# EAGLE design PIO-Breakout (EAGLE 9.6.2)
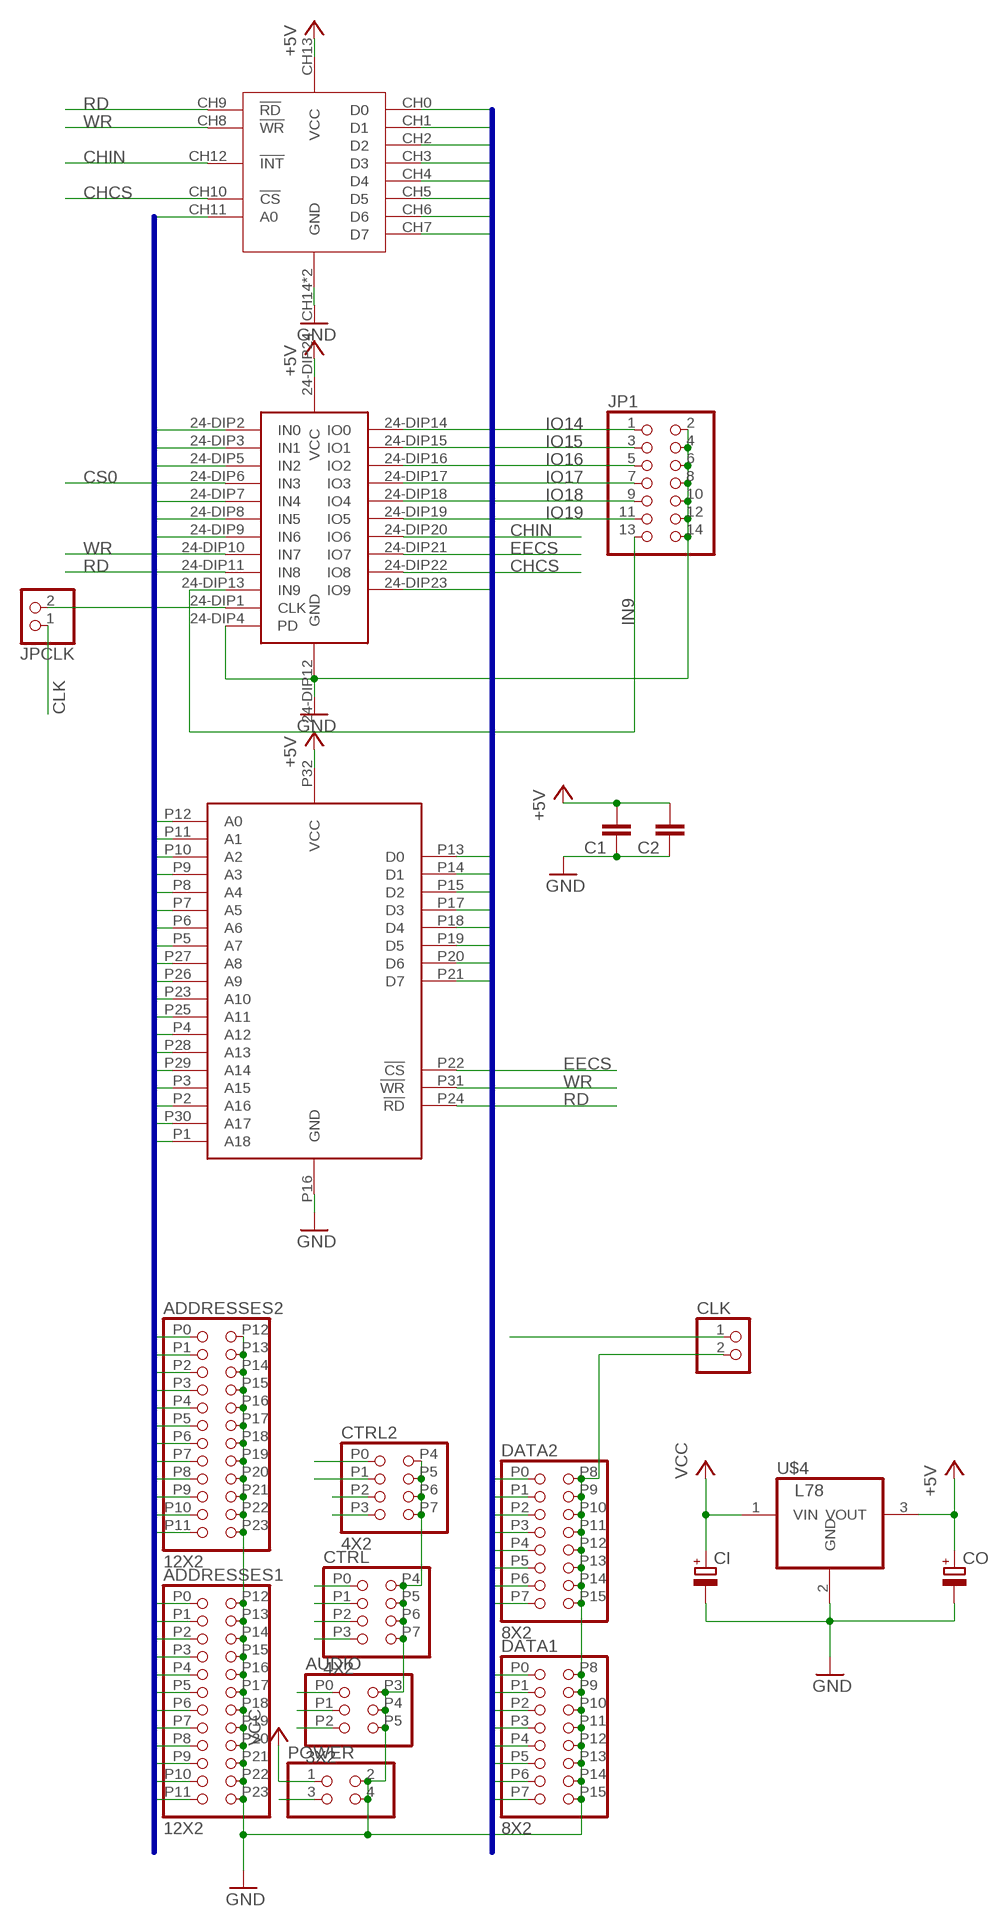
[diagram p0: schematic, sheet 1]

## Parts
ADDRESSES1  12X2  [12X2]
ADDRESSES2  12X2  [12X2]
AUDIO  3X2  [3X2]
C1  C-EU025-024X044  [C025-024X044]
C2  C-EU025-024X044  [C025-024X044]
CI  CPOL-EUE2,5-6E  [E2,5-6E]
CLK  PINHD-1X2  [1X02]
CO  CPOL-EUE2,5-6E  [E2,5-6E]
CTRL  4X2  [4X2]
CTRL2  4X2  [4X2]
DATA1  8X2  [8X2]
DATA2  8X2  [8X2]
JP1  PINHD-2X7  [2X07]
JPCLK  PINHD-1X2  [1X02]
POWER  PINHD-2X2  [2X02]
U$1  AT29C040A  [DIP-32]
U$2  ATF22V10C-10PU  [24-DIP]
U$3  CH375B-BOARD  [CH375B-BOARD]
U$4  L78  [TO-220-HEATSINK]

## Nets
+3V3: POWER.3
+5V: C1.2 C2.2 CO.+ U$1.P32(VCC) U$2.24-DIP24(VCC) U$3.CH13(VCC) U$4.3(VOUT)
A0: ADDRESSES1.P11 U$1.P12(A0) U$2.24-DIP2(IN0) U$3.CH11(A0)
A1: ADDRESSES2.P11 U$1.P11(A1) U$2.24-DIP3(IN1)
A2: ADDRESSES1.P10 U$1.P10(A2) U$2.24-DIP5(IN2)
A3: ADDRESSES2.P10 U$1.P9(A3)
A4: ADDRESSES1.P9 U$1.P8(A4)
A5: ADDRESSES2.P9 U$1.P7(A5)
A6: ADDRESSES1.P8 U$1.P6(A6)
A7: ADDRESSES2.P8 U$1.P5(A7)
A8: ADDRESSES1.P7 U$1.P27(A8)
A9: ADDRESSES2.P7 U$1.P26(A9)
A10: ADDRESSES1.P6 U$1.P23(A10)
A11: ADDRESSES2.P6 U$1.P25(A11)
A12: ADDRESSES1.P5 U$1.P4(A12)
A13: ADDRESSES2.P5 U$1.P28(A13)
A14: ADDRESSES1.P4 U$1.P29(A14)
A15: ADDRESSES2.P4 U$1.P3(A15)
A16: ADDRESSES1.P3 U$1.P2(A16) U$2.24-DIP7(IN4)
A17: ADDRESSES2.P3 U$1.P30(A17) U$2.24-DIP8(IN5)
A18: ADDRESSES1.P2 U$1.P1(A18) U$2.24-DIP9(IN6)
A19: ADDRESSES2.P2
A20: ADDRESSES1.P1
A21: ADDRESSES2.P1
A22: ADDRESSES1.P0
A23: ADDRESSES2.P0
BCLK: AUDIO.P2
CHCS: U$2.24-DIP22(IO8) U$3.CH10(!CS)
CHIN: U$2.24-DIP20(IO6) U$3.CH12(!INT)
CLK: CLK.1 JPCLK.1
CS0: CTRL.P0 U$2.24-DIP6(IN3)
CS2: CTRL.P1
CS5: CTRL2.P0
D0: DATA1.P7 U$1.P13(D0) U$2.24-DIP23(IO9) U$3.CH0(D0)
D1: DATA2.P7 U$1.P14(D1) U$3.CH1(D1)
D2: DATA1.P6 U$1.P15(D2) U$3.CH2(D2)
D3: DATA2.P6 U$1.P17(D3) U$3.CH3(D3)
D4: DATA1.P5 U$1.P18(D4) U$3.CH4(D4)
D5: DATA2.P5 U$1.P19(D5) U$3.CH5(D5)
D6: DATA1.P4 U$1.P20(D6) U$3.CH6(D6)
D7: DATA2.P4 U$1.P21(D7) U$3.CH7(D7)
D8: DATA1.P3
D9: DATA2.P3
D10: DATA1.P2
D11: DATA2.P2
D12: DATA1.P1
D13: DATA2.P1
D14: DATA1.P0
D15: DATA2.P0
EECS: U$1.P22(!CS) U$2.24-DIP21(IO7)
GND: ADDRESSES1.P12 ADDRESSES1.P13 ADDRESSES1.P14 ADDRESSES1.P15 ADDRESSES1.P16 ADDRESSES1.P17 ADDRESSES1.P18 ADDRESSES1.P19 ADDRESSES1.P20 ADDRESSES1.P21 ADDRESSES1.P22 ADDRESSES1.P23 ADDRESSES2.P12 ADDRESSES2.P13 ADDRESSES2.P14 ADDRESSES2.P15 ADDRESSES2.P16 ADDRESSES2.P17 ADDRESSES2.P18 ADDRESSES2.P19 ADDRESSES2.P20 ADDRESSES2.P21 ADDRESSES2.P22 ADDRESSES2.P23 AUDIO.P3 AUDIO.P4 AUDIO.P5 C1.1 C2.1 CI.- CLK.2 CO.- CTRL2.P4 CTRL2.P5 CTRL2.P6 CTRL2.P7 CTRL.P4 CTRL.P5 CTRL.P6 CTRL.P7 DATA1.P8 DATA1.P9 DATA1.P10 DATA1.P11 DATA1.P12 DATA1.P13 DATA1.P14 DATA1.P15 DATA2.P8 DATA2.P9 DATA2.P10 DATA2.P11 DATA2.P12 DATA2.P13 DATA2.P14 DATA2.P15 JP1.2 JP1.4 JP1.6 JP1.8 JP1.10 JP1.12 JP1.14 POWER.2 POWER.4 U$1.P16(GND) U$2.24-DIP4(PD) U$2.24-DIP12(GND) U$3.CH14(GND) U$3.CH15(GND) U$4.2(GND)
IN2: CTRL2.P1
IN9: JP1.13 U$2.24-DIP13(IN9)
IN10: CTRL.P2
IO14: JP1.1 U$2.24-DIP14(IO0)
IO15: JP1.3 U$2.24-DIP15(IO1)
IO16: JP1.5 U$2.24-DIP16(IO2)
IO17: JP1.7 U$2.24-DIP17(IO3)
IO18: JP1.9 U$2.24-DIP18(IO4)
IO19: JP1.11 U$2.24-DIP19(IO5)
LRCLK: AUDIO.P1
MCLK: JPCLK.2 U$2.24-DIP1(CLK)
RD: CTRL2.P2 U$1.P24(!RD) U$2.24-DIP11(IN8) U$3.CH9(!RD)
RESET: CTRL.P3
SDIN: AUDIO.P0
VCC: CI.+ POWER.1 U$4.1(VIN)
WR: CTRL2.P3 U$1.P31(!WR) U$2.24-DIP10(IN7) U$3.CH8(!WR)

## Buses
A0,A1,A2,A3,A4,A5,A6,A7,A8,A9,A10,A11,A12,A13,A14,A15,A16,A17,A18,A19,A20,A21,A22,A23
D0,D1,D2,D3,D4,D5,D6,D7,D8,D9,D10,D11,D12,D13,D14,D15

## Library data of the parts
ADDRESSES1 ADDRESSES2 = pixel:12X2
AUDIO = pixel:3X2
C1 C2 = rcl:C-EU: CAPACITOR, European symbol; SPICEPREFIX: C
CI CO = rcl:CPOL-EU: POLARIZED CAPACITOR, European symbol; SPICEPREFIX: C
CLK JPCLK = pinhead:PINHD-1X2: PIN HEADER
CTRL CTRL2 = pixel:4X2
DATA1 DATA2 = pixel:8X2
JP1 = pinhead:PINHD-2X7: PIN HEADER
POWER = pinhead:PINHD-2X2: PIN HEADER
U$1 = pixel:AT29C040A
U$2 = pixel:ATF22V10C-10PU
U$3 = pixel:CH375B-BOARD
U$4 = pixel:L78

## Board
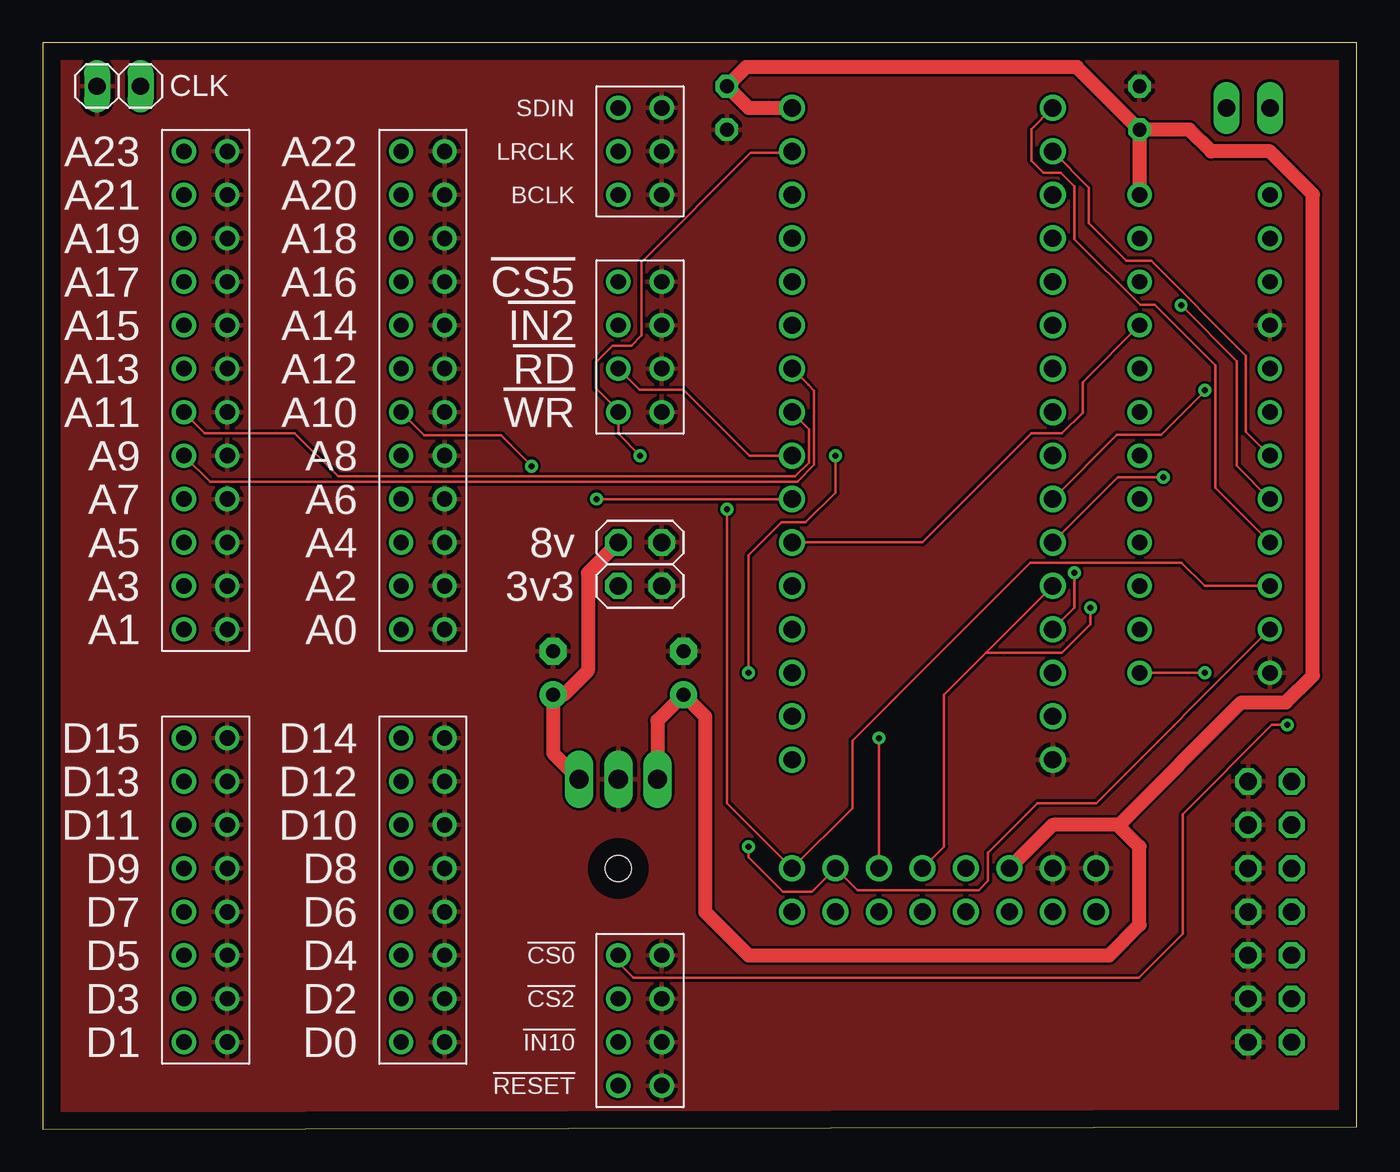
[diagram p1: board, top side]
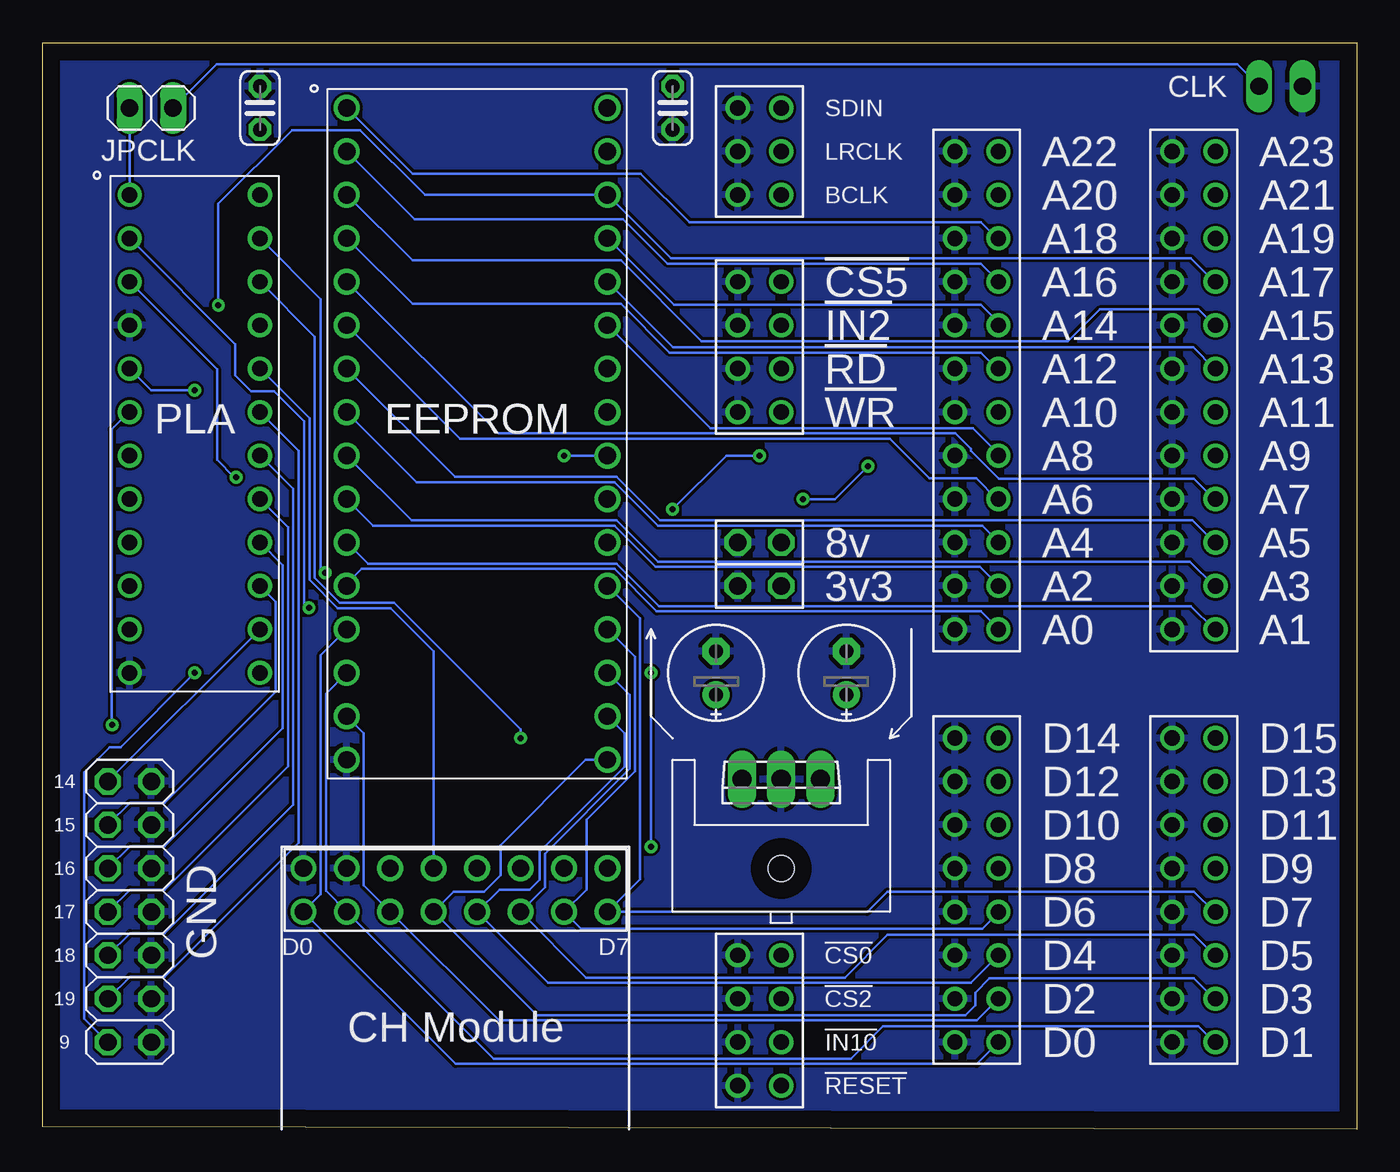
[diagram p2: board, bottom side, seen from below]

Size 76.83 x 63.5 mm. Coordinates in mm from the lower left corner, seen from the top.
Outline: 0,0 76.83,0.13 76.83,63.5 0,63.5 0,0
Copper layers (1*16): Top 0.035mm / dielectric 1.5mm / Bottom 0.035mm
Design rules "default *": minimum track width 6mil, minimum drill 10mil, track to track 6mil, track to pad 6mil, pad to pad 6mil, via to via 6mil, smd to smd 6mil, copper to edge 40mil, drill to drill 6mil, minimum pad ring 10mil, minimum via ring 8mil, stop-mask expansion 4mil, vias tented up to drill 500mil, thermal gap 10mil

### Footprints (pad centres in the part's own frame; a part is rotated, then mirrored left to right if it is on the bottom)
12X2 = drill 0.9 pad 1.27: P0 -1.27,13.97; P1 -1.27,11.43; P2 -1.27,8.89; P3 -1.27,6.35; P4 -1.27,3.81; P5 -1.27,1.27; P6 -1.27,-1.27; P7 -1.27,-3.81; P8 -1.27,-6.35; P9 -1.27,-8.89; P10 -1.27,-11.43; P11 -1.27,-13.97; P12 1.27,-13.97; P13 1.27,-11.43; P14 1.27,-8.89; P15 1.27,-6.35; P16 1.27,-3.81; P17 1.27,-1.27; P18 1.27,1.27; P19 1.27,3.81; P20 1.27,6.35; P21 1.27,8.89; P22 1.27,11.43; P23 1.27,13.97
3X2 = drill 0.9 pad 1.27: P0 -1.27,2.54; P1 -1.27,0; P2 -1.27,-2.54; P3 1.27,-2.54; P4 1.27,0; P5 1.27,2.54
C025-024X044 = drill 0.813 octagon: 1 -1.27,0; 2 1.27,0
E2,5-6E = drill 0.813 pad 1.575: + -1.27,0 | drill 0.813 pad 1.575 octagon: - 1.27,0
1X02 = drill 1.016 long: 1 -1.27,0; 2 1.27,0
4X2 = drill 0.9 pad 1.27: P0 -1.27,3.81; P1 -1.27,1.27; P2 -1.27,-1.27; P3 -1.27,-3.81; P4 1.27,-3.81; P5 1.27,-1.27; P6 1.27,1.27; P7 1.27,3.81
8X2 = drill 0.9 pad 1.27: P0 -1.27,8.89; P1 -1.27,6.35; P2 -1.27,3.81; P3 -1.27,1.27; P4 -1.27,-1.27; P5 -1.27,-3.81; P6 -1.27,-6.35; P7 -1.27,-8.89; P8 1.27,-8.89; P9 1.27,-6.35; P10 1.27,-3.81; P11 1.27,-1.27; P12 1.27,1.27; P13 1.27,3.81; P14 1.27,6.35; P15 1.27,8.89
2X07 = drill 1.016 octagon: 1 -7.62,-1.27; 2 -7.62,1.27; 3 -5.08,-1.27; 4 -5.08,1.27; 5 -2.54,-1.27; 6 -2.54,1.27; 7 0,-1.27; 8 0,1.27; 9 2.54,-1.27; 10 2.54,1.27; 11 5.08,-1.27; 12 5.08,1.27; 13 7.62,-1.27; 14 7.62,1.27
2X02 = drill 1.016 octagon: 1 -1.27,-1.27; 2 -1.27,1.27; 3 1.27,-1.27; 4 1.27,1.27
DIP-32 = drill 1.016: P1 -7.62,19.05; P2 -7.62,16.51; P3 -7.62,13.97; P4 -7.62,11.43; P5 -7.62,8.89; P6 -7.62,6.35; P7 -7.62,3.81; P8 -7.62,1.27; P9 -7.62,-1.27; P10 -7.62,-3.81; P11 -7.62,-6.35; P12 -7.62,-8.89; P13 -7.62,-11.43; P14 -7.62,-13.97; P15 -7.62,-16.51; P16 -7.62,-19.05; P17 7.62,-19.05; P18 7.62,-16.51; P19 7.62,-13.97; P20 7.62,-11.43; P21 7.62,-8.89; P22 7.62,-6.35; P23 7.62,-3.81; P24 7.62,-1.27; P25 7.62,1.27; P26 7.62,3.81; P27 7.62,6.35; P28 7.62,8.89; P29 7.62,11.43; P30 7.62,13.97; P31 7.62,16.51; P32 7.62,19.05
24-DIP = drill 0.9: 24-DIP1 -3.81,13.97; 24-DIP2 -3.81,11.43; 24-DIP3 -3.81,8.89; 24-DIP4 -3.81,6.35; 24-DIP5 -3.81,3.81; 24-DIP6 -3.81,1.27; 24-DIP7 -3.81,-1.27; 24-DIP8 -3.81,-3.81; 24-DIP9 -3.81,-6.35; 24-DIP10 -3.81,-8.89; 24-DIP11 -3.81,-11.43; 24-DIP12 -3.81,-13.97; 24-DIP13 3.81,-13.97; 24-DIP14 3.81,-11.43; 24-DIP15 3.81,-8.89; 24-DIP16 3.81,-6.35; 24-DIP17 3.81,-3.81; 24-DIP18 3.81,-1.27; 24-DIP19 3.81,1.27; 24-DIP20 3.81,3.81; 24-DIP21 3.81,6.35; 24-DIP22 3.81,8.89; 24-DIP23 3.81,11.43; 24-DIP24 3.81,13.97
CH375B-BOARD = drill 1: CH0 -1.27,8.89; CH1 -1.27,6.35; CH2 -1.27,3.81; CH3 -1.27,1.27; CH4 -1.27,-1.27; CH5 -1.27,-3.81; CH6 -1.27,-6.35; CH7 -1.27,-8.89; CH8 1.27,-8.89; CH9 1.27,-6.35; CH10 1.27,-3.81; CH11 1.27,-1.27; CH12 1.27,1.27; CH13 1.27,3.81; CH14 1.27,6.35; CH15 1.27,8.89
TO-220-HEATSINK = drill 1.118 long: 1 -2.286,-1.397; 2 0,-1.397; 3 2.286,-1.397 | hole 1.5: 0,3.81

### Placement (x,y rotation side)
ADDRESSES1  22.23,43.18 0 top
ADDRESSES2  9.53,43.18 0 top
AUDIO  34.92,57.15 0 top
C1  40,59.69 90 bottom
C2  64.14,59.69 270 bottom
CI  29.84,26.67 90 bottom
CLK  4.45,60.96 180 top
CO  37.46,26.67 90 bottom
CTRL  34.92,6.35 0 top
CTRL2  34.92,45.72 0 top
DATA1  22.23,13.97 0 top
DATA2  9.53,13.97 0 top
JP1  71.75,12.7 270 bottom
JPCLK  70.48,59.69 180 bottom
POWER  34.92,33.02 270 top
U$1  51.43,40.64 0 bottom
U$2  67.94,40.64 0 bottom
U$3  52.7,13.97 90 bottom
U$4  33.66,19.05 180 bottom

### Tracks (layer width: path | path; a pad name or v marks a point on that pad's centre or on a via)
+5V
  Top 0.813: 62.9,17.74 64.14,16.51 64.14,11.94 62.36,10.16 41.27,10.16 38.73,12.7 38.73,24.13 CO.+ 35.94,23.88 U$4.3 | 62.9,17.74 62.86,17.78 59.05,17.78 U$3.CH13 | 62.9,17.74 70.1,24.94 72.7,24.94 74.27,26.51 74.27,54.63 71.75,57.15 68.33,57.15 67.06,58.42 C2.2 | C2.2 U$2.24-DIP24 | C2.2 60.48,62.08 41.12,62.08 C1.2 41.27,59.69 U$1.P32
A0  (via drill 0.35)
  Top 0.152: U$3.CH11 52.7,16.51 52.7,25.4 55.14,27.84 | 55.14,27.84 59.59,27.84 61.27,29.52 v61.27,30.48 | U$1.P12 55.14,27.84
  Bottom 0.152: ADDRESSES1.P11 20.95,29.26 21.97,30.27 40.93,30.27 43.41,32.74 58.19,32.74 59.05,31.88 U$1.P12 | U$2.24-DIP2 65.58,45.89 65.58,44.06 64.65,43.14 63.29,43.14 61.54,41.38 61.54,30.7 61.32,30.48 v61.27,30.48
A1  (via drill 0.35)
  Top 0.152: v65.53,38.1 62.86,38.1 U$1.P11
  Bottom 0.152: ADDRESSES2.P11 8.33,29.21 9.7,30.57 40.81,30.57 43.28,33.05 57.81,33.05 U$1.P11 | v65.53,38.1 65.63,38.1 66.64,39.11 66.64,44.42 U$2.24-DIP3
A2  (via drill 0.35)
  Top 0.152: U$1.P10 62.82,40.6 65.41,40.6 67.94,43.13 v67.94,43.18
  Bottom 0.152: U$1.P10 57.51,35.28 43.41,35.28 40.99,32.87 22.02,32.87 20.95,31.8 ADDRESSES1.P10 | v67.94,43.18 70.48,43.18 U$2.24-DIP5
A3
  Bottom 0.152: U$1.P9 55.27,35.59 43.28,35.59 40.86,33.17 9.76,33.17 8.33,31.75 ADDRESSES2.P10
A4
  Bottom 0.152: U$1.P8 54.97,37.82 43.41,37.82 40.86,35.28 21.9,35.28 20.95,34.34 ADDRESSES1.P9
A5
  Bottom 0.152: U$1.P7 52.73,38.12 43.28,38.12 40.74,35.59 9.63,35.59 8.33,34.29 ADDRESSES2.P9
A6
  Bottom 0.152: ADDRESSES1.P8 21.03,36.83 22.25,38.05 24.99,38.05 27.3,40.36 52.43,40.36 U$1.P6
A7
  Bottom 0.152: U$1.P5 50.19,40.66 23.47,40.66 22.56,39.76 22.56,39.66 20.92,38.02 9.52,38.02 8.33,36.83 ADDRESSES2.P8
A8
  Bottom 0.152: U$1.P27 37.8,40.97 22.46,40.97 20.95,39.47 ADDRESSES1.P7
A9
  Top 0.152: ADDRESSES2.P7 9.78,37.85 44.12,37.85 45.11,38.83 45.11,43.16 44.77,43.5 U$1.P26
A10  (via drill 0.35)
  Top 0.152: ADDRESSES1.P6 22.31,40.56 26.8,40.56 28.57,38.78 v28.57,38.76 | v32.38,36.83 U$1.P23
  Bottom 0.152: v28.57,38.76 30.5,36.83 v32.38,36.83
A11
  Top 0.152: U$1.P25 44.81,40.92 44.81,38.96 44,38.15 17.27,38.15 14.74,40.68 9.48,40.68 ADDRESSES2.P6
A12
  Bottom 0.152: ADDRESSES1.P5 21.03,44.45 21.97,45.38 40.17,45.38 43.02,48.23 55.22,48.23 U$1.P4
A13
  Bottom 0.152: U$1.P28 39.97,45.69 9.57,45.69 8.33,44.45 ADDRESSES2.P5
A14
  Bottom 0.152: ADDRESSES1.P4 20.95,47.17 21.97,48.18 39.92,48.18 U$1.P29
A15
  Bottom 0.152: ADDRESSES2.P4 8.33,46.99 9.27,47.92 15.02,47.92 16.89,46.06 38.31,46.06 43.02,50.77 55.22,50.77 U$1.P3
A16
  Top 0.152: U$2.24-DIP7 70.36,40.77 70.36,45.21 64.81,50.76 63.37,50.76 61.17,52.95 61.17,55.03 U$1.P2
  Bottom 0.152: ADDRESSES1.P3 20.95,49.58 21.97,50.59 40.3,50.59 42.9,53.19 55.09,53.19 U$1.P2
A17  (via drill 0.35)
  Top 0.152: U$2.24-DIP8 69.82,38.76 69.82,44.89 v66.56,48.15
  Bottom 0.152: ADDRESSES2.P3 8.33,49.53 9.7,50.89 40.1,50.89 U$1.P30 54.48,54.61 58.26,58.4 62.26,58.4 66.56,54.09 v66.56,48.15
A18
  Top 0.152: U$2.24-DIP9 68.55,37.49 68.55,44.64 65.02,48.18 64.17,48.18 60.33,52.02 60.33,55.12 59.54,55.91 58.52,55.91 57.81,56.61 57.81,58.45 U$1.P1
  Bottom 0.152: ADDRESSES1.P2 21.03,52.07 21.97,53 39.03,53 41.88,55.85 55.22,55.85 U$1.P1
CHCS  (via drill 0.35)
  Top 0.152: v48.89,22.86 U$3.CH10
  Bottom 0.152: U$2.24-DIP22 60.93,46.33 60.93,32.23 59.47,30.76 56.29,30.76 48.89,23.37 v48.89,22.86
CHIN
  Bottom 0.152: U$2.24-DIP20 61.24,41.55 61.24,32.1 59.59,30.45 56.49,30.45 53.97,27.94 U$3.CH12
CLK
  Bottom 0.152: CLK.1 6.99,62.23 66.67,62.23 JPCLK.1
CS0  (via drill 0.35)
  Top 0.152: CTRL.P0 33.66,9.73 34.54,8.85 64.09,8.85 66.67,11.43 66.67,18.41 71.88,23.62 v72.77,23.62
  Bottom 0.152: v72.77,23.62 72.77,23.66 72.81,23.7 72.81,40.9 71.8,41.91 U$2.24-DIP6
D0  (via drill 0.35)
  Top 0.152: v60.33,32.51 60.33,30.48 U$1.P13
  Bottom 0.152: DATA1.P7 22.23,3.81 52.7,3.81 U$3.CH0 60.58,13.72 60.58,27.69 U$1.P13 | U$2.24-DIP23 60.58,48.51 60.58,32.77 v60.33,32.51
D1
  Bottom 0.152: DATA2.P7 8.33,5.08 9.27,6.01 27.69,6.01 29.59,4.12 50.47,4.12 U$3.CH1 60.27,13.93 60.27,25.45 U$1.P14
D2
  Bottom 0.152: DATA1.P6 22.23,6.35 50.16,6.35 U$3.CH2 58.06,14.25 58.06,23.14 U$1.P15
D3
  Bottom 0.152: DATA2.P6 8.33,7.62 9.52,8.81 21.47,8.81 22.31,7.97 22.31,7.23 22.89,6.66 47.93,6.66 U$3.CH3 52.8,13.88 51.03,13.88 50.07,14.83 50.07,16.6 45.09,21.59 U$1.P17
D4
  Bottom 0.152: DATA1.P5 22.56,8.55 47.29,8.55 U$3.CH4 50.13,14 48.36,14 47.78,14.58 47.78,16.22 42.82,21.18 42.82,23.14 U$1.P18
D5
  Bottom 0.152: DATA2.P5 8.33,10.16 9.52,11.35 27.44,11.35 29.93,8.86 45.05,8.86 U$3.CH5 47.46,14.13 47.46,16.11 42.52,21.05 42.52,25.38 U$1.P19
D6
  Bottom 0.152: DATA1.P4 20.95,12.65 21.89,11.72 45.36,11.72 U$3.CH6 45.05,14 45.05,18.09 42.21,20.93 42.21,27.61 U$1.P20
D7
  Bottom 0.152: DATA2.P4 8.33,12.7 9.52,13.89 27.44,13.89 28.62,12.7 U$3.CH7 41.91,14.61 41.91,29.85 U$1.P21
EECS
  Top 0.152: U$1.P22 51.43,34.29 57.81,40.66 59.59,40.66 60.81,41.88 60.81,43.66 U$2.24-DIP21
GND
  pour Bottom: -0.63,63.5 -0.63,0 76.83,0 76.83,63.5
  pour Top: -0.63,63.5 76.83,63.5 76.83,0 -0.63,0
IN9  (via drill 0.35)
  Top 0.152: v67.94,26.67 U$2.24-DIP13
  Bottom 0.152: JP1.13 74.4,6.45 74.4,20.86 72.93,22.33 72.29,22.33 v67.94,26.67
IO14
  Bottom 0.152: JP1.1 U$2.24-DIP14
IO15
  Bottom 0.152: JP1.3 71.73,19.07 69.69,19.07 63.2,25.57 63.2,30.82 U$2.24-DIP15
IO16
  Bottom 0.152: JP1.5 71.73,16.54 69.69,16.54 62.79,23.43 62.79,32.95 U$2.24-DIP16
IO17
  Bottom 0.152: JP1.7 71.73,13.99 69.69,13.99 62.49,21.2 62.49,35.18 U$2.24-DIP17
IO18
  Bottom 0.152: JP1.9 71.73,11.46 69.69,11.46 62.18,18.96 62.18,37.42 U$2.24-DIP18
IO19
  Bottom 0.152: JP1.11 71.73,8.91 69.69,8.91 61.88,16.73 61.88,39.65 U$2.24-DIP19
MCLK
  Bottom 0.152: JPCLK.2 U$2.24-DIP1
RD  (via drill 0.35)
  Top 0.152: CTRL2.P2 34.88,43.22 37.47,43.22 41.32,39.37 U$1.P24 | v41.27,16.51 41.27,15.88 43.28,13.88 44.98,13.88 U$3.CH9 47.62,13.97 54.74,13.97 55.28,14.51 55.28,16.16 58.17,19.05 61.59,19.05 U$2.24-DIP11 | v46.35,39.37 46.35,37.21 44.61,35.46 43.2,35.46 41.27,33.53 v41.27,26.67
  Bottom 0.152: v41.27,16.51 v41.27,26.67 | v46.35,39.37 U$1.P24
VCC
  Top 0.813: POWER.1 31.88,32.51 31.88,26.8 30.48,25.4 CI.+ 29.84,21.97 U$4.1
WR  (via drill 0.35)
  Top 0.152: U$1.P31 43.73,57.07 41.4,57.07 35.01,50.68 35.01,46.39 34.42,45.8 33.31,45.8 32.34,44.84 32.34,43.3 33.66,41.99 CTRL2.P3 33.66,40.64 v34.92,39.37 | U$2.24-DIP10 67.94,31.75 66.58,33.12 57.75,33.12 47.34,22.7 47.34,18.76 U$3.CH8 40,19.05 v40,36.22
  Bottom 0.152: v40,36.22 36.86,39.37 v34.92,39.37

### Text on the board
tNames: SDIN | A23 | A22 | LRCLK | A21 | A20 | BCLK | A19 | A18 | A17 | A16 | !CS5 | A15 | A14 | !IN2 | A13 | A12 | !RD | A11 | A10 | !WR | A9 | A8 | A7 | A6 | A5 | A4 | 8v | A3 | A2 | 3v3 | A1 | A0 | D15 | D14 | D13 | D12 | D11 | D10 | D9 | D8 | D7 | D6 | D5 | D4 | !CS0 | D3 | D2 | !CS2 | D1 | D0 | !IN10 | !RESET
bNames: CLK | SDIN | A23 | A22 | LRCLK | A21 | A20 | BCLK | A19 | A18 | A17 | A16 | !CS5 | A15 | A14 | !IN2 | A13 | A12 | !RD | A11 | A10 | !WR | EEPROM | PLA | A9 | A8 | A7 | A6 | A5 | A4 | 8v | A3 | A2 | 3v3 | A1 | A0 | D15 | D14 | D13 | D12 | 14 | D11 | D10 | 15 | D9 | D8 | 16 | D7 | D6 | GND | 17 | D5 | D4 | !CS0 | D7 | D0 | 18 | D3 | D2 | !CS2 | 19 | D1 | D0 | !IN10 | CH Module | 9 | !RESET